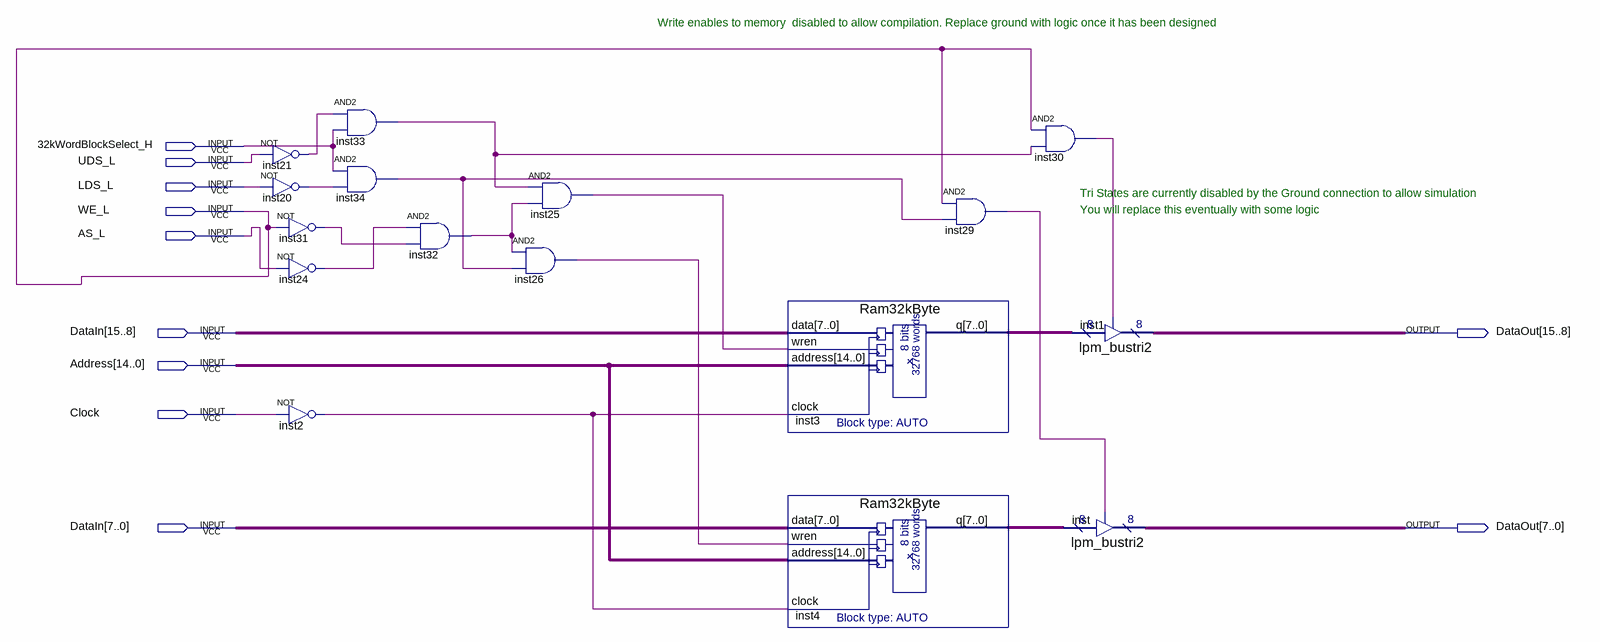
[diagram p0: schematic sheet]
// Quartus schematic SramBlock_32KWord.bdf as structural Verilog: 16 symbols, 11 pins
module SramBlock_32KWord (
  input  \32kWordBlockSelect_H ,
  input  UDS_L,
  input  LDS_L,
  input  WE_L,
  input  AS_L,
  input  [15:0] DataIn,
  input  [14:0] Address,
  input  Clock,
  output [15:0] DataOut
);

  wire inst2_out, inst20_out, inst21_out, inst24_out, inst25_out, inst26_out, inst29_out, inst30_out,
       inst31_out, inst32_out, inst33_out, inst34_out;
  wire [7:0] inst3_q, inst4_q;

  not inst21 (inst21_out, UDS_L);
  not inst20 (inst20_out, LDS_L);
  not inst31 (inst31_out, WE_L);
  not inst24 (inst24_out, AS_L);
  not inst2 (inst2_out, Clock);
  and inst33 (inst33_out, inst21_out, \32kWordBlockSelect_H );
  and inst34 (inst34_out, \32kWordBlockSelect_H , inst20_out);
  and inst32 (inst32_out, inst24_out, inst31_out);
  and inst25 (inst25_out, inst33_out, inst32_out);
  and inst26 (inst26_out, inst32_out, inst34_out);
  Ram32kByte inst3 (.data(DataIn[15:8]), .wren(inst25_out), .address(Address), .clock(inst2_out), .q(inst3_q));
  Ram32kByte inst4 (.data(DataIn[7:0]), .wren(inst26_out), .address(Address), .clock(inst2_out), .q(inst4_q));
  and inst29 (inst29_out, WE_L, inst34_out);
  and inst30 (inst30_out, WE_L, inst33_out);
  lpm_bustri2 inst1 (.enabledt(inst30_out), .data(inst3_q), .tridata(DataOut[15:8]));
  lpm_bustri2 inst (.enabledt(inst29_out), .data(inst4_q), .tridata(DataOut[7:0]));

  // Notes on the sheet:
  //   Write enables to memory  disabled to allow compilation. Replace ground with logic once it has been designed
  //   Tri States are currently disabled by the Ground connection to allow simulation
  //   You will replace this eventually with some logic
endmodule
